# EAGLE design XBee2 (EAGLE 6.4)
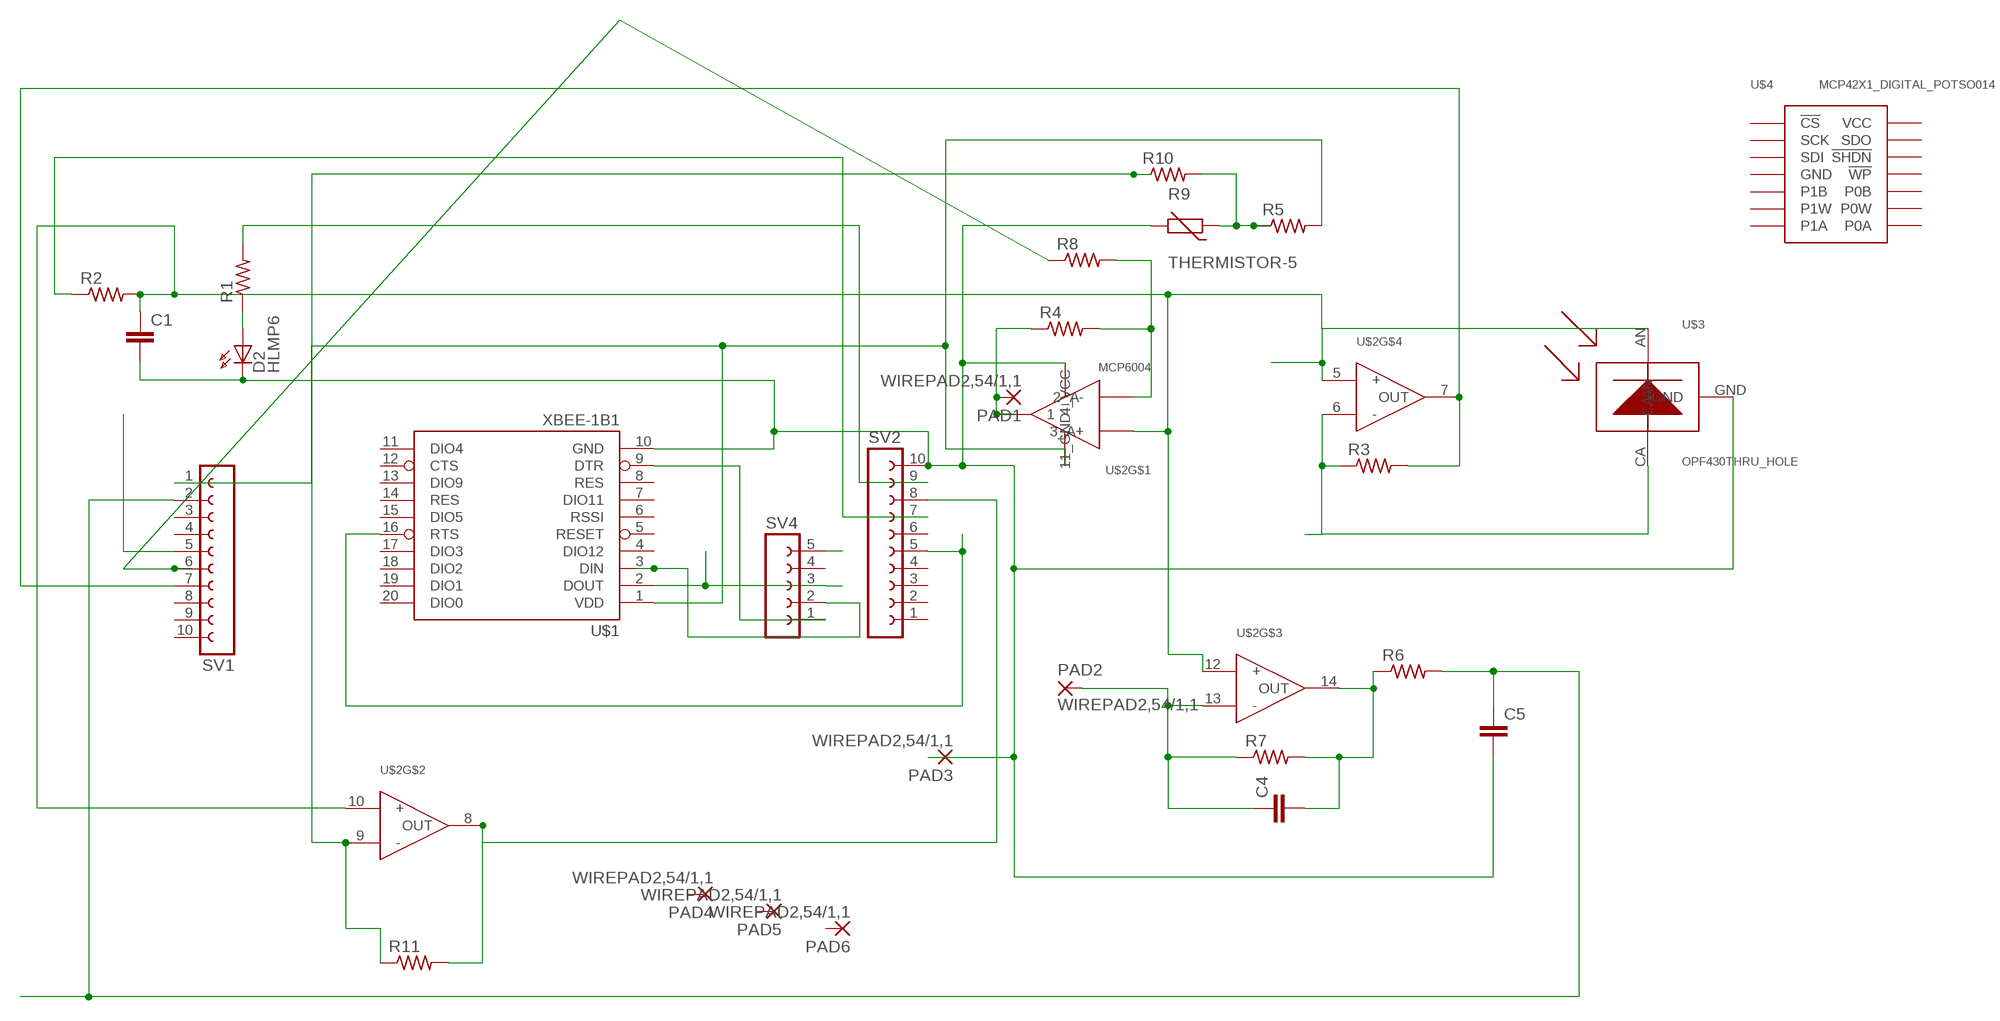
[diagram p0: schematic, sheet 1]

## Parts
C1  C-EUC1206  [C1206]
C4  C-EUC1206  [C1206]
C5  C-EUC1206  [C1206]
D2  HLMP6  [HLMP6]
PAD1  WIREPAD2,54/1,1  [2,54/1,1]
PAD2  WIREPAD2,54/1,1  [2,54/1,1]
PAD3  WIREPAD2,54/1,1  [2,54/1,1]
PAD4  WIREPAD2,54/1,1  [2,54/1,1]
PAD5  WIREPAD2,54/1,1  [2,54/1,1]
PAD6  WIREPAD2,54/1,1  [2,54/1,1]
R1  R-US_M1206  [M1206]
R2  R-US_M1206  [M1206]
R3  R-US_M1206  [M1206]
R4  R-US_M1206  [M1206]
R5  R-US_M1206  [M1206]
R6  R-US_M1206  [M1206]
R7  R-US_M1206  [M1206]
R8  R-US_M1206  [M1206]
R9  THERMISTOR-5  [R-5]
R10  R-US_M1206  [M1206]
R11  R-US_M1206  [M1206]
SV1  FE10-1  [FE10]
SV2  FE10-1  [FE10]
SV4  FE05-1  [FE05-1]
U$1  XBEE-1B1  [XBEE-1]
U$2  MCP6004  [SO014]
U$3  OPF430THRU_HOLE  [OPF430]
U$4  MCP42X1_DIGITAL_POTSO014  [SO014]

## Nets
GND: C1.2 C5.2 D2.K PAD3.1(P) R9.2 SV2.10 U$1.10(GND) U$2.11(11_GND) U$3.GND
N$1: R5.2 SV1.1 U$1.1(VDD) U$2.4(4_VCC)
N$2: R3.1 U$2.6(-) U$3.CA
N$3: SV4.3 U$1.2(DOUT)
N$4: SV4.1 U$1.9(DTR)
N$5: SV4.2 U$1.3(DIN)
N$6: SV1.5
N$7: C1.1 R2.2 U$2.3(3_A+) U$2.5(+) U$2.10(+) U$2.12(+) U$3.AN
N$8: D2.A R1.1
N$9: R3.2 SV1.7 U$2.7(OUT)
N$11: R2.1 SV2.7
N$12: R11.2 SV2.8 U$2.8(OUT)
N$13: R10.1 R11.1 U$2.9(-)
N$14: PAD1.1(P) R4.1 U$2.1
N$15: R1.2 SV2.9
N$16: R8.1 SV1.6
N$17: C4.1 PAD2.1(P) R7.1 U$2.13(-)
N$18: C4.2 R6.1 R7.2 U$2.14(OUT)
N$19: C5.1 R6.2 SV1.2
N$20: R5.1 R9.1 R10.2
N$21: R4.2 R8.2 U$2.2(2_A-)
N$22: SV2.5 U$1.16(RTS)
N$23: SV4.5
Unconnected: PAD4.1(P) PAD5.1(P) PAD6.1(P) SV1.3 SV1.4 SV1.8 SV1.9 SV1.10 SV2.1 SV2.2 SV2.3 SV2.4 SV2.6 SV4.4 U$1.4(DIO12) U$1.5(RESET) U$1.6(RSSI) U$1.7(DIO11) U$1.8(RES) U$1.11(DIO4) U$1.12(CTS) U$1.13(DIO9) U$1.14(RES) U$1.15(DIO5) U$1.17(DIO3) U$1.18(DIO2) U$1.19(DIO1) U$1.20(DIO0) U$4.P1(!CS) U$4.P2(SCK) U$4.P3(SDI) U$4.P4(GND) U$4.P5(P1B) U$4.P6(P1W) U$4.P7(P1A) U$4.P8(P0A) U$4.P9(P0W) U$4.P10(P0B) U$4.P11(!WP) U$4.P12(!SHDN) U$4.P13(SDO) U$4.P14(VCC)

## Library data of the parts
C1 C4 C5 = rcl:C-EU: CAPACITOR, European symbol
D2 = display-hp:HLMP6: LED 2mm horizontal; MF: AGILENT TECHNOLOGIES; MPN: HLMP-6500; OC_FARNELL: 1652490; OC_NEWARK: 40K0088
PAD1-PAD6 = wirepad:WIREPAD: Wire PAD connect wire on PCB
R1-R8 R10 R11 = rcl:R-US_: RESISTOR, American symbol
R9 = varistor:THERMISTOR: THERMISTOR
SV1 SV2 = con-lsta:FE10-1: FEMALE HEADER; OC_FARNELL: unknown; OC_NEWARK: unknown
SV4 = con-lsta:FE05-1: FEMALE HEADER; OC_FARNELL: unknown; OC_NEWARK: unknown
U$1 = SparkFun-RF:XBEE-1: Xbee module footprints SMT header is CONN-09042.
U$2 = SparkFun-AnalogIC:MCP6004: 14SOIC quad op amp, R2R, low power
U$3 = JackLibrary:OPF430: OPF430 Fiber Optic Detector, 900 nm wavelength
U$4 = JackLibrary:MCP42X1_DIGITAL_POT

## Board
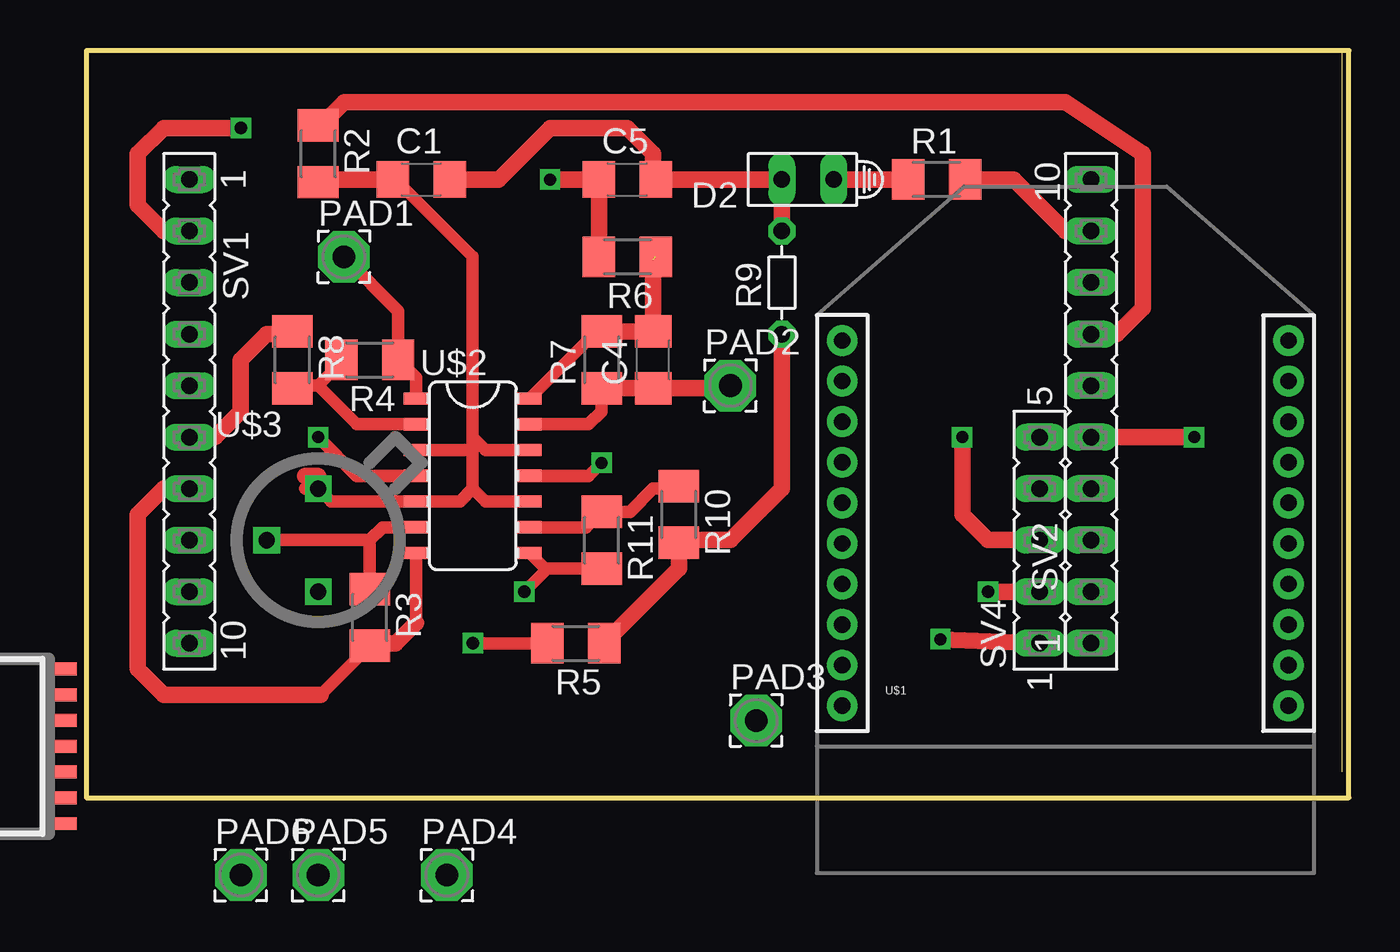
[diagram p1: board, top side]
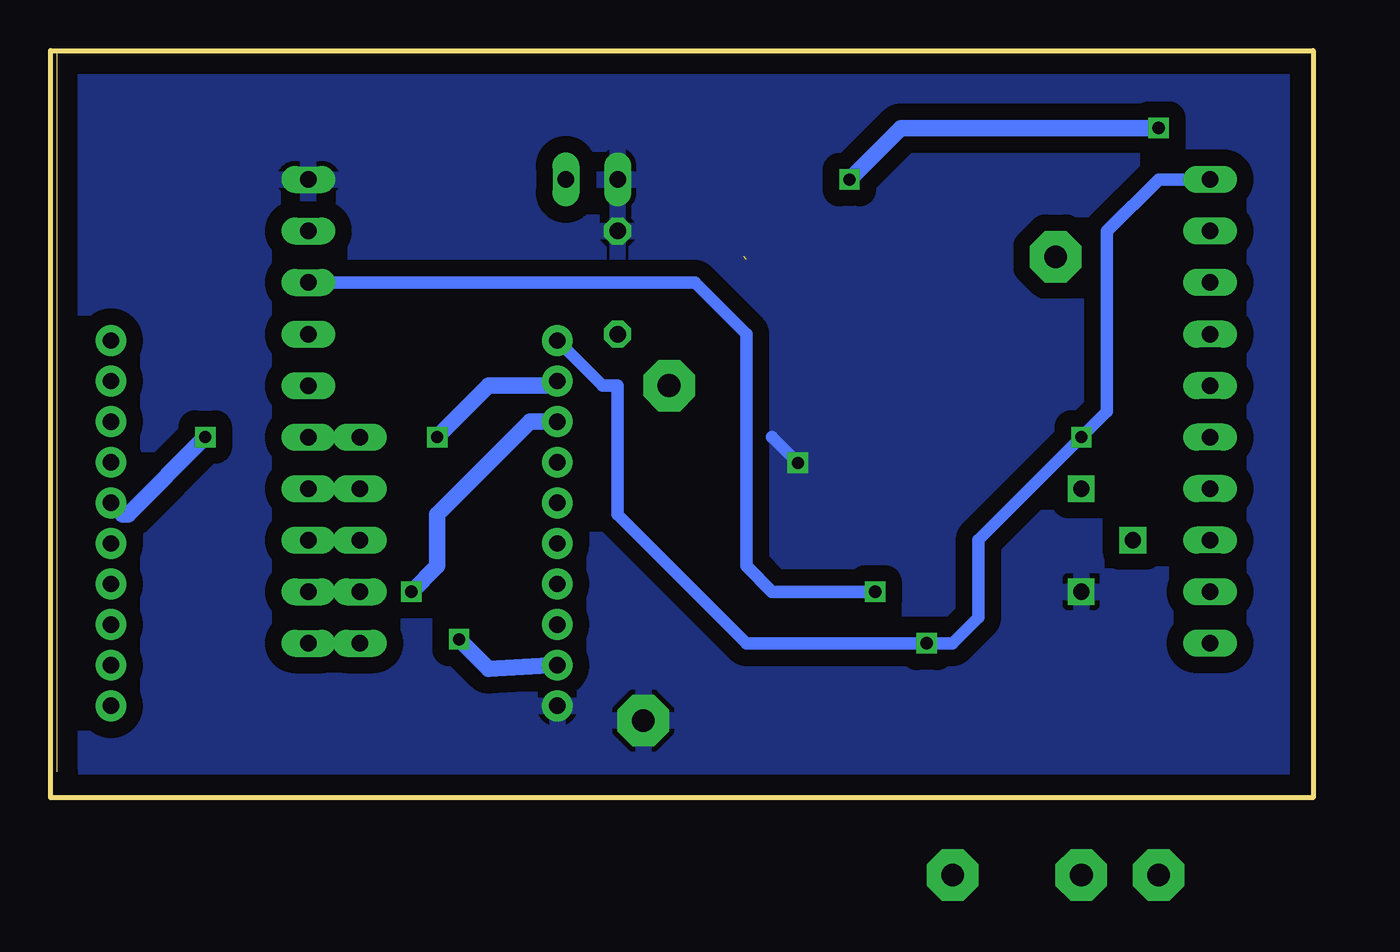
[diagram p2: board, bottom side, seen from below]

Size 62.23 x 36.83 mm. Coordinates in mm from the lower left corner, seen from the top.
Outline: 61.9,1.27 61.9,36.82 0,36.82
Outline: 0,36.83 0,0 62.23,0 62.23,36.83 0,36.83
Copper layers (1*16): Top 0.035mm / dielectric 1.5mm / Bottom 0.035mm
Design rules "default": minimum track width 10mil, minimum drill 24mil, track to track 8mil, track to pad 8mil, pad to pad 8mil, via to via 8mil, smd to smd 8mil, copper to edge 40mil, drill to drill 8mil, minimum pad ring 10mil, minimum via ring 8mil, stop-mask expansion 4mil, vias tented up to drill 0mil, thermal gap 10mil

### Footprints (pad centres in the part's own frame; a part is rotated, then mirrored left to right if it is on the bottom)
C1206 = smd 1.6 x 1.8: 1 -1.4,0; 2 1.4,0
HLMP6 = drill 0.813 long: A -1.27,0; K 1.27,0
2,54/1,1 = drill 1.118 pad 2.54 octagon: 1 0,0
M1206 = smd 1.6 x 2: 1 -1.4,0; 2 1.4,0
R-5 = drill 0.813 octagon: 1 -2.54,0; 2 2.54,0
FE10 = drill 0.813 long: 1 -11.43,0; 2 -8.89,0; 3 -6.35,0; 4 -3.81,0; 5 -1.27,0; 6 1.27,0; 7 3.81,0; 8 6.35,0; 9 8.89,0; 10 11.43,0
FE05-1 = drill 0.813 long: 1 -5.08,0; 2 -2.54,0; 3 0,0; 4 2.54,0; 5 5.08,0
XBEE-1 = drill 0.8 pad 1.524: 1 -11,20; 2 -11,18; 3 -11,16; 4 -11,14; 5 -11,12; 6 -11,10; 7 -11,8; 8 -11,6; 9 -11,4; 10 -11,2; 11 11,2; 12 11,4; 13 11,6; 14 11,8; 15 11,10; 16 11,12; 17 11,14; 18 11,16; 19 11,18; 20 11,20
SO014 = smd 0.6 x 1.2: 1 -3.175,-2.8; 2 -1.905,-2.8; 3 -0.635,-2.8; 4 0.635,-2.8; 5 1.905,-2.8; 6 3.175,-2.8; 7 4.445,-2.8; 8 4.445,2.8; 9 3.175,2.8; 10 1.905,2.8; 11 0.635,2.8; 12 -0.635,2.8; 13 -1.905,2.8; 14 -3.175,2.8
OPF430 = drill 0.8 square: AN 0,2.54; CA -2.54,0; GND 0,-2.54
SO014' = smd 1.27 x 0.635: P1 -2.692,3.81; P2 -2.692,2.54; P3 -2.692,1.27; P4 -2.692,0; P5 -2.692,-1.27; P6 -2.692,-2.54; P7 -2.692,-3.81; P8 2.692,-3.81; P9 2.692,-2.54; P10 2.692,-1.27; P11 2.692,0; P12 2.692,1.27; P13 2.692,2.54; P14 2.692,3.81

### Placement (x,y rotation side)
C1  16.51,30.48 0 top
C4  27.94,21.59 90 top
C5  26.67,30.48 0 top
D2  35.56,30.48 180 top
PAD1  12.7,26.67 0 top
PAD2  31.75,20.32 0 top
PAD3  33.02,3.81 0 top
PAD4  17.78,-3.81 0 top  (outside the outline)
PAD5  11.43,-3.81 0 top  (outside the outline)
PAD6  7.62,-3.81 0 top  (outside the outline)
R1  41.91,30.48 0 top
R2  11.43,31.75 270 top
R3  13.97,8.89 270 top
R4  13.97,21.59 180 top
R5  24.13,7.62 180 top
R6  26.67,26.67 180 top
R7  25.4,21.59 90 top
R8  10.16,21.59 270 top
R9  34.29,25.4 90 top
R10  29.21,13.97 270 top
R11  25.4,12.7 270 top
SV1  5.08,19.05 270 top
SV2  49.53,19.05 90 top
SV4  46.99,12.7 90 top
U$1  48.26,2.54 0 top
U$2  19.05,16.51 270 top
U$3  11.43,12.7 0 top
U$4  MCP42X1_DIGITAL_POTSO014  [SO014']  -3.81,2.54 0 top

### Tracks (layer width: path | path; a pad name or v marks a point on that pad's centre or on a via)
GND  (via drill 0.6)
  Top 0.61: U$2.11 24.77,15.87 v25.4,16.51
  Top 0.813: R9.2 D2.K C5.2 27.94,30.61 27.94,31.75 26.67,33.02 22.86,33.02 20.32,30.48 C1.2
  Bottom 0.61: v25.4,16.51 26.67,17.78
  pour Bottom (isolate 0.813): 1.27,1.27 1.27,36.83 62.23,36.83 62.23,1.27
N$1  (via drill 0.6)
  Top 0.61: 22.86,7.62 R5.2 v19.05,7.62 | U$2.4 13.34,15.87 v11.43,17.78
  Bottom 0.61: U$1.1 35.04,20.32 34.29,20.32 34.29,13.97 27.94,7.62 v19.05,7.62 17.78,7.62 16.51,8.89 16.51,12.7 v11.43,17.78 10.16,19.05 10.16,27.94 7.62,30.48 SV1.1
N$2
  Top 0.61: U$2.6 14.61,13.33 13.97,12.7 | 13.97,12.7 R3.1 | U$3.CA 13.97,12.7
  Top 0.813: 13.97,10.16 R3.1
N$3  (via drill 0.6)
  Top 0.813: SV4.3 44.45,12.7 43.18,13.97 v43.18,17.78
  Bottom 0.813: v43.18,17.78 40.64,20.32 37.48,20.32 U$1.2
N$4  (via drill 0.6)
  Top 0.813: v42.1,7.81 SV4.1
  Bottom 0.813: U$1.9 40.64,6.35 v42.1,7.81
N$5  (via drill 0.6)
  Top 0.813: v44.45,10.16 SV4.2
  Bottom 0.813: U$1.3 38.61,18.54 43.18,13.97 43.18,11.43 v44.45,10.16
N$7
  Top 0.61: 11.43,15.87 10.8,15.24 U$3.AN 12.07,14.6 U$2.5 18.41,14.6 19.05,15.24 | 19.05,17.14 U$2.3 | U$2.10 19.68,14.6 19.05,15.24 | 19.05,15.24 19.05,17.14 | C1.1 15.24,30.48 19.05,26.67 19.05,17.78 | 19.05,17.78 19.05,17.14 | U$2.12 19.68,17.14 19.05,17.78
  Top 0.813: 11.43,15.87 10.8,15.87 | C1.1 11.56,30.48 R2.2
N$8
  Top 0.813: R1.1 D2.A
N$9
  Top 0.61: 11.56,5.08 R3.2 | U$2.7 16.25,8.63
  Top 0.813: 16.25,8.63 15.24,7.62 14.1,7.62 R3.2 | SV1.7 3.81,15.24 2.54,13.97 2.54,6.35 3.81,5.08 11.56,5.08
N$11
  Top 0.813: SV2.7 50.8,22.86 52.07,24.13 52.07,31.75 48.26,34.29 12.7,34.29 11.56,33.15 R2.1
N$12  (via drill 0.6)
  Top 0.61: U$2.8 22.62,11.3 R11.2 22.73,11.3 v21.59,10.16
  Bottom 0.61: v21.59,10.16 26.67,10.16 27.94,11.43 27.94,22.86 30.48,25.4 SV2.8
N$13
  Top 0.61: U$2.9 24.63,13.33 R11.1 26.8,14.1 27.94,15.24 29.08,15.24 R10.1
N$14
  Top 0.61: U$2.1 16.25,20.71 R4.1 15.37,24 PAD1.1
N$15
  Top 0.813: R1.2 45.72,30.48 48.26,27.94 SV2.9
N$16
  Top 0.813: SV1.6 6.35,17.78 7.62,19.05 7.62,21.59 8.89,22.86 10.03,22.86 R8.1
N$17
  Top 0.61: U$2.13 24.77,18.42 25.4,19.05 R7.1
  Top 0.813: R7.1 C4.1 31.62,20.19 PAD2.1
N$18  (1 unrouted)
  Top 0.61: R7.2 25.4,22.86 25.02,22.86 U$2.14
  Top 0.813: R7.2 C4.2 27.94,26.54
N$19  (via drill 0.6)
  Top 0.813: R6.2 C5.1 v22.86,30.48 | SV1.2 3.81,27.94 2.54,29.21 2.54,31.75 3.81,33.02 v7.62,33.02
  Bottom 0.813: v7.62,33.02 20.32,33.02 v22.86,30.48
N$20
  Top 0.813: R9.1 34.29,15.24 31.75,12.7 29.34,12.7 R10.2 29.21,11.3 R5.1
N$21
  Top 0.61: U$2.2 13.34,18.42 11.43,20.32 | 11.43,20.32 10.29,20.32 R8.2 | R4.2 12.57,21.46 11.43,20.32
N$22  (via drill 0.6)
  Top 0.813: SV2.5 v54.61,17.78
  Bottom 0.813: v54.61,17.78 58.42,13.97 58.69,13.97 U$1.16